# EAGLE design node-v2 (EAGLE 7.2.0)

## Sheet 1 of 2
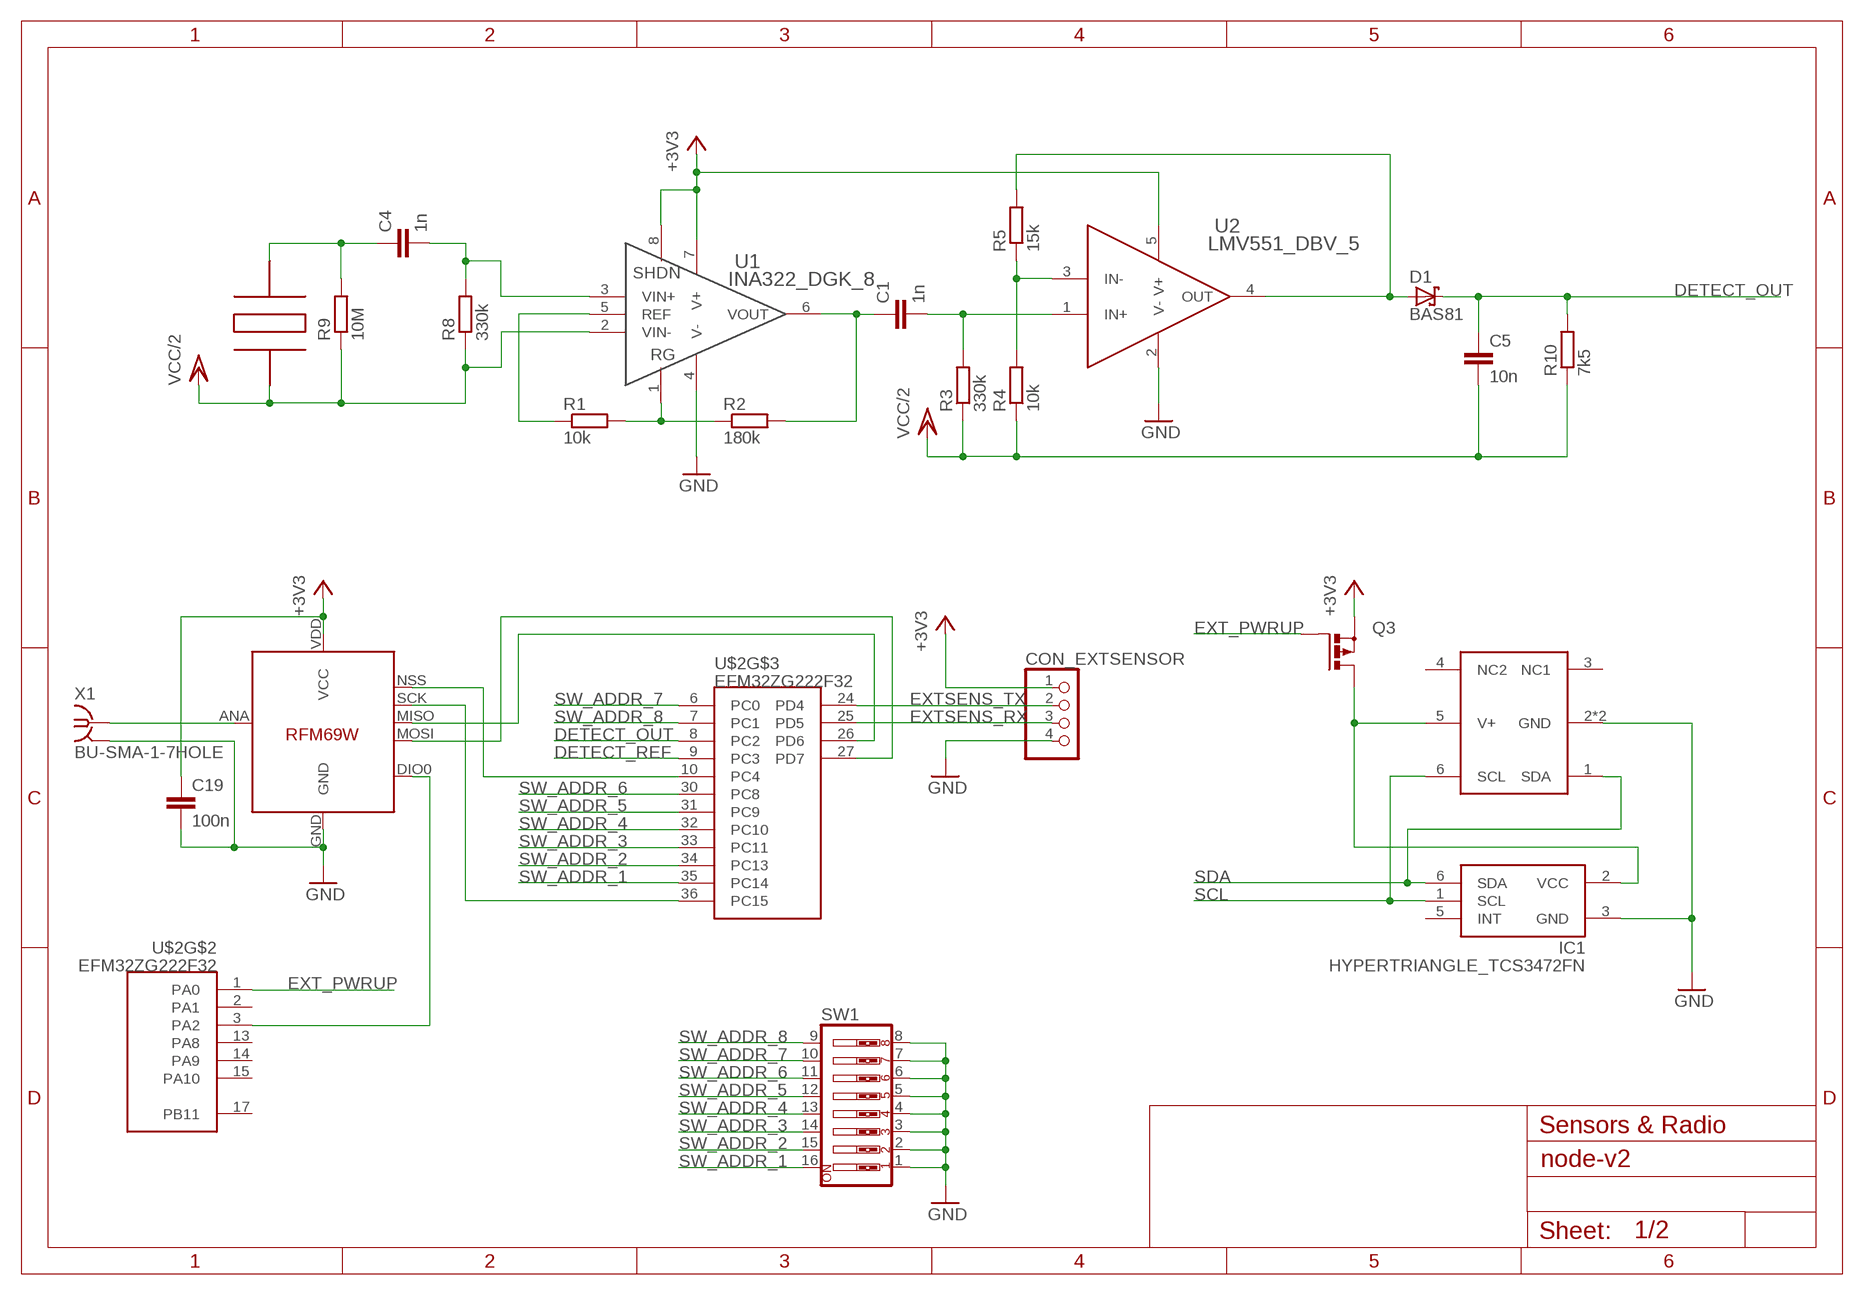
[diagram p0: schematic, sheet 1]

### Parts
C1  1n  CAPPTH  [CAP-PTH-SMALL]
C4  1n  CAPPTH  [CAP-PTH-SMALL]
C5  10n  CAPPTH  [CAP-PTH-SMALL]
C19  100n  CAPPTH  [CAP-PTH-SMALL]
CON_EXTSENSOR  PINHD-1X4  [1X04]
D1  BAS81  SCHOTTKY-DIODEDO35-7  [DO35-7]
IC1  HYPERTRIANGLE_TCS3472FN  [HYPERTRIANGLE_DFN-6]
Q3  PMOSFET_PTO220BH  [TO220BH]
R1  10k  R-EU_0204/7  [0204/7]
R2  180k  R-EU_0204/7  [0204/7]
R3  330k  R-EU_0204/7  [0204/7]
R4  10k  R-EU_0204/7  [0204/7]
R5  15k  R-EU_0204/7  [0204/7]
R8  330k  R-EU_0204/7  [0204/7]
R9  10M  R-EU_0204/7  [0204/7]
R10  7k5  R-EU_0204/7  [0204/7]
RADIO  RFM69  [RFM69W-MINPADS]
SW1  SW_DIP-8  [DIPSWITCH-08]
U1  INA322_DGK_8  [DGK8]
U2  LMV551_DBV_5  [MF05A]
U$1  PIEZOWIREHEADER  [1X02]
U$2  EFM32ZG222F32  [QFP48]
U$3  SHT21  [SHT21]
X1  BU-SMA-1-7HOLE  [SMA_1-7HOLES]

### Nets
+3V3: C19.1 CON_EXTSENSOR.1 Q3.S RADIO.VDD(VCC) U1.7(V+) U1.8(SHDN) U2.5(V+) ; also sheet 2
DETECT_OUT: C5.1 D1.C R10.2 U$2.8(PC2)
DETECT_REF: U$2.9(PC3) ; also sheet 2
EXT_PWRLINE: IC1.2(VCC) Q3.D U$3.5(V+)
EXT_PWRUP: Q3.G U$2.1(PA0)
EXTSENS_RX: CON_EXTSENSOR.3 U$2.25(PD5)
EXTSENS_TX: CON_EXTSENSOR.2 U$2.24(PD4)
GND: C19.2 CON_EXTSENSOR.4 IC1.3(GND) RADIO.GND SW1.1 SW1.2 SW1.3 SW1.4 SW1.5 SW1.6 SW1.7 SW1.8 U1.4(V-) U2.2(V-) U$3.2(GND) U$3.P$1(GND) X1.2 X1.3 X1.4 X1.5 ; also sheet 2
INSTR_FILTERED: C1.2 R3.2 U2.1(IN+)
INSTR_OUT: C1.1 R2.2 U1.6(VOUT)
N$1: RADIO.MISO U$2.26(PD6)
OPAMP_OUT: D1.A R5.2 U2.4(OUT)
OPAMP_VGND: R4.2 R5.1 U2.3(IN-)
PIEZO_FILTERED: C4.2 R8.2 U1.3(VIN+)
PIEZO_OUT: C4.1 R9.2 U$1.1(S+)
RADIO_ANT: RADIO.ANA(ANT) X1.1
RADIO_CS: RADIO.NSS(SEL) U$2.10(PC4)
RADIO_INT: RADIO.DIO0 U$2.3(PA2)
RADIO_MOSI: RADIO.MOSI U$2.27(PD7)
RADIO_SCK: RADIO.SCK U$2.36(PC15)
REFLINE: R1.1 U1.5(REF)
RGLINE: R1.2 R2.1 U1.1(RG)
SCL: IC1.1(SCL) U$3.6(SCL) ; also sheet 2
SDA: IC1.6(SDA) U$3.1(SDA) ; also sheet 2
SW_ADDR_1: SW1.16 U$2.35(PC14)
SW_ADDR_2: SW1.15 U$2.34(PC13)
SW_ADDR_3: SW1.14 U$2.33(PC11)
SW_ADDR_4: SW1.13 U$2.32(PC10)
SW_ADDR_5: SW1.12 U$2.31(PC9)
SW_ADDR_6: SW1.11 U$2.30(PC8)
SW_ADDR_7: SW1.10 U$2.6(PC0)
SW_ADDR_8: SW1.9 U$2.7(PC1)
VCC/2: C5.2 R3.1 R4.1 R8.1 R9.1 R10.1 U1.2(VIN-) U$1.2(S-) ; also sheet 2
Unconnected: IC1.5(INT) U$2.2(PA1) U$2.13(PA8) U$2.14(PA9) U$2.15(PA10) U$2.17(PB11) U$3.3(NC1) U$3.4(NC2)

### Notes on the sheet
- Sensors & Radio

## Sheet 2 of 2
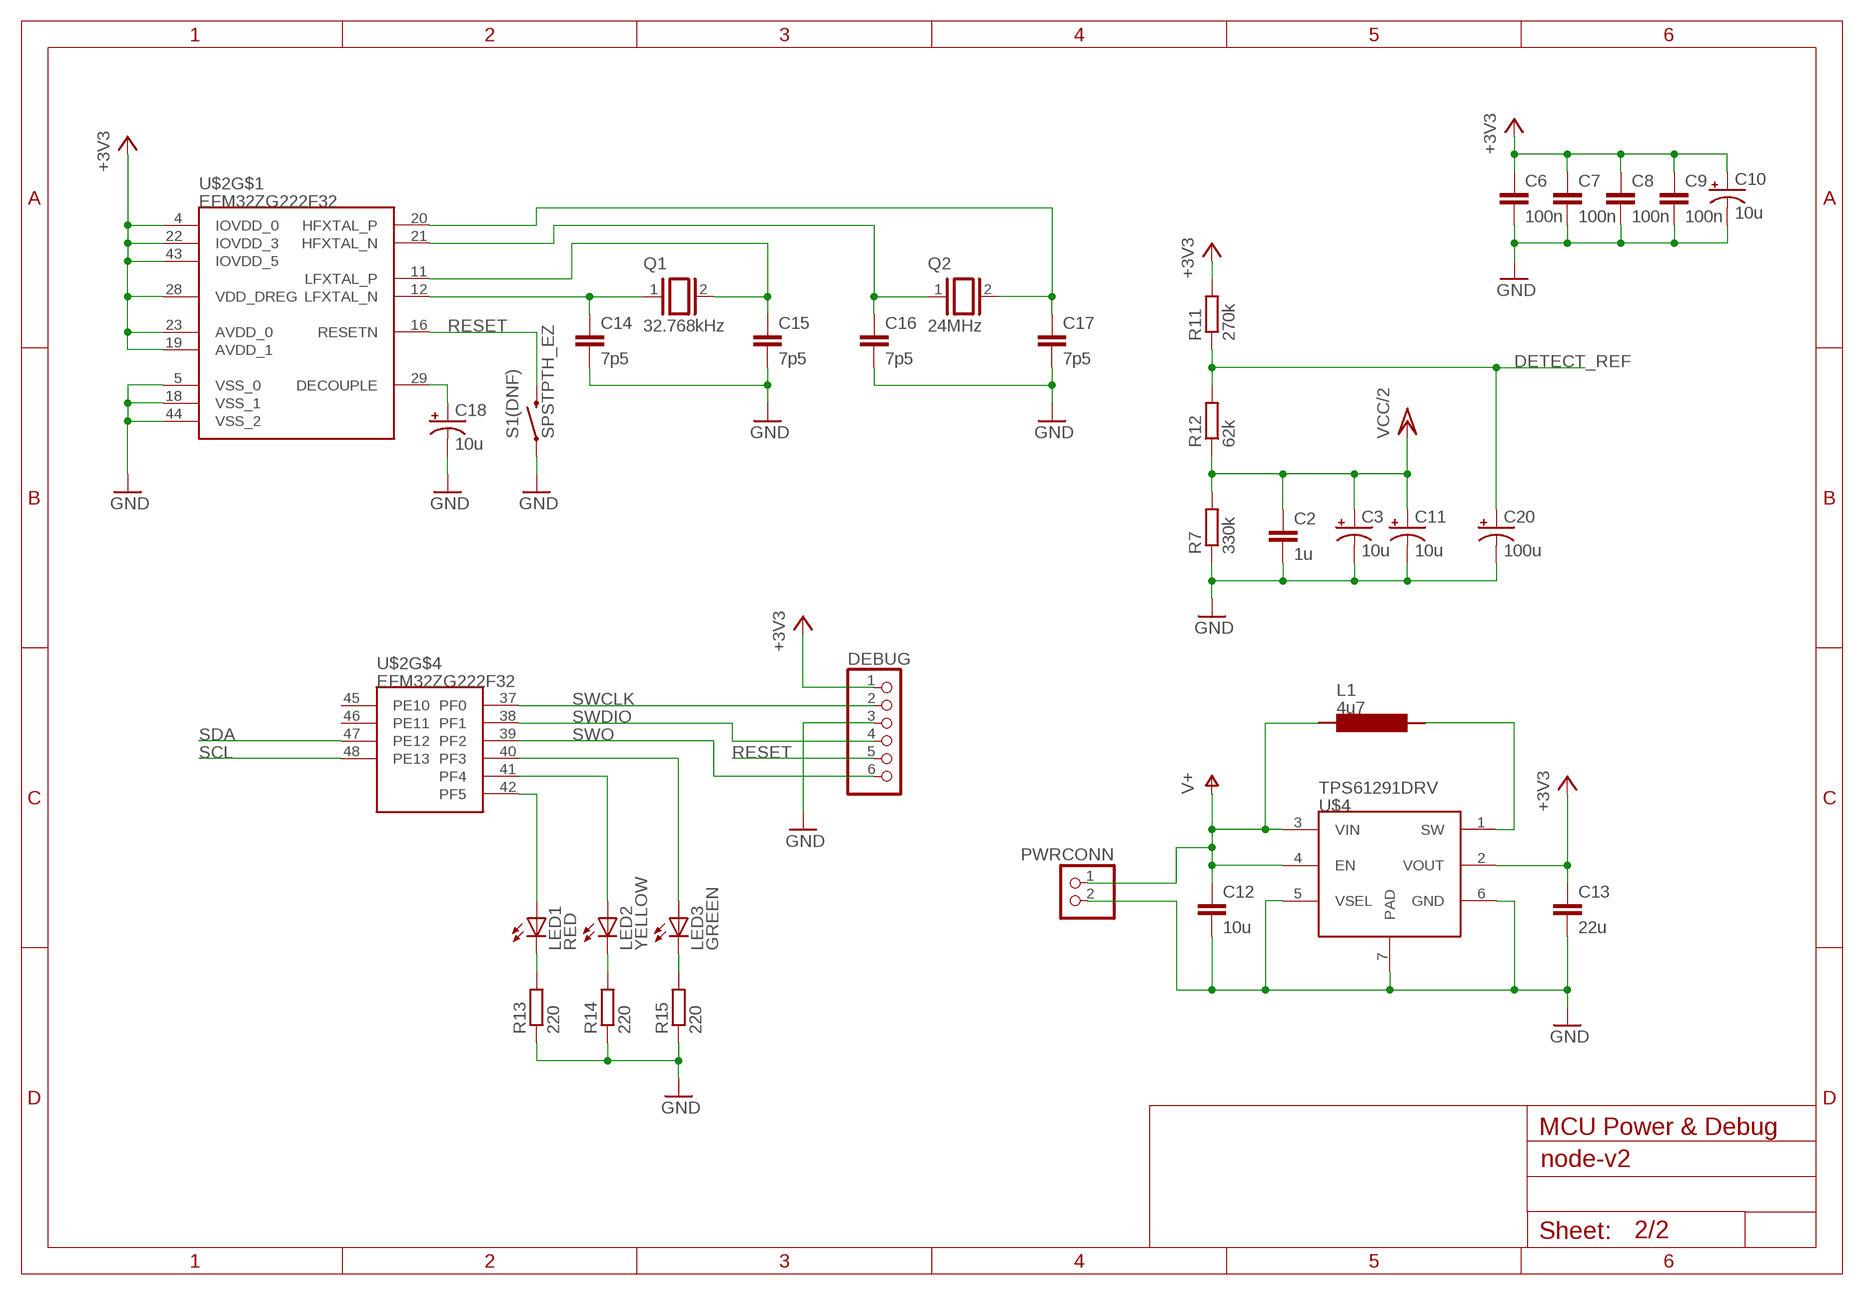
[diagram p1: schematic, sheet 2]

### Parts
C2  1u  CAPPTH  [CAP-PTH-SMALL]
C3  10u  CAP_POLPTH2  [CPOL-RADIAL-10UF-25V]
C6  100n  CAPPTH  [CAP-PTH-SMALL]
C7  100n  CAPPTH1  [CAP-PTH-5MM]
C8  100n  CAPPTH  [CAP-PTH-SMALL]
C9  100n  CAPPTH  [CAP-PTH-SMALL]
C10  10u  CAP_POLPTH2  [CPOL-RADIAL-10UF-25V]
C11  10u  CAP_POLPTH2  [CPOL-RADIAL-10UF-25V]
C12  10u  CAP1206  [1206]
C13  22u  CAP1206  [1206]
C14  7p5  CAPPTH  [CAP-PTH-SMALL]
C15  7p5  CAPPTH  [CAP-PTH-SMALL]
C16  7p5  CAPPTH  [CAP-PTH-SMALL]
C17  7p5  CAPPTH  [CAP-PTH-SMALL]
C18  10u  CAP_POLPTH2  [CPOL-RADIAL-10UF-25V]
C20  100u  CAP_POLPTH2  [CPOL-RADIAL-10UF-25V]
DEBUG  PINHD-1X6  [1X06]
L1  4u7  LTF5022  [LTF5022]
LED1  RED  LED3MM  [LED3MM]
LED2  YELLOW  LED3MM  [LED3MM]
LED3  GREEN  LED3MM  [LED3MM]
PWRCONN  PINHD-1X2  [1X02]
Q1  32.768kHz  XTAL/S  [QS]
Q2  24MHz  XTAL/S  [QS]
R7  330k  R-EU_0204/7  [0204/7]
R11  270k  R-EU_0204/7  [0204/7]
R12  62k  R-EU_0204/7  [0204/7]
R13  220  R-EU_0204/7  [0204/7]
R14  220  R-EU_0204/7  [0204/7]
R15  220  R-EU_0204/7  [0204/7]
S1(DNF)  SPSTPTH_EZ  [TACTILE-PTH-EZ]
U$4  TPS61291DRV  [DRV0006A]

### Nets
+3V3: C6.1 C7.1 C8.1 C9.1 C10.1(+) C13.1 DEBUG.1 R11.2 U$2.4(IOVDD_0) U$2.19(AVDD_1) U$2.22(IOVDD_3) U$2.23(AVDD_0) U$2.28(VDD_DREG) U$2.43(IOVDD_5) U$4.2(VOUT) ; also sheet 1
DECOUPLE: C18.1(+) U$2.29(DECOUPLE)
DETECT_REF: C20.1(+) R11.1 R12.2 ; also sheet 1
GND: C2.2 C3.2(-) C6.2 C7.2 C8.2 C9.2 C10.2(-) C11.2(-) C12.2 C13.2 C14.2 C15.2 C16.2 C17.2 C18.2(-) C20.2(-) DEBUG.3 PWRCONN.2 R7.1 R13.1 R14.1 R15.1 S1(DNF).1 U$2.5(VSS_0) U$2.18(VSS_1) U$2.44(VSS_2) U$4.5(VSEL) U$4.6(GND) U$4.7(PAD) ; also sheet 1
LED_GREEN: LED3.A U$2.40(PF3)
LED_RED: LED1.A U$2.42(PF5)
LED_YELLOW: LED2.A U$2.41(PF4)
LFXTAL_N: C15.1 Q1.2 U$2.11(LFXTAL_P)
LFXTAL_P: C14.1 Q1.1 U$2.12(LFXTAL_N)
N$9: LED1.K(C) R13.2
N$10: LED2.K(C) R14.2
N$11: LED3.K(C) R15.2
RESET: DEBUG.5 S1(DNF).3 U$2.16(RESETN)
SCL: U$2.48(PE13) ; also sheet 1
SDA: U$2.47(PE12) ; also sheet 1
SWCLK: DEBUG.2 U$2.37(PF0)
SWDIO: DEBUG.4 U$2.38(PF1)
SWO: DEBUG.6 U$2.39(PF2)
V+: C12.1 L1.1 PWRCONN.1 U$4.3(VIN) U$4.4(EN)
VCC/2: C2.1 C3.1(+) C11.1(+) R7.2 R12.1 ; also sheet 1
VREG_SW: L1.2 U$4.1(SW)
XTALN: C17.1 Q2.2 U$2.20(HFXTAL_P)
XTALP: C16.1 Q2.1 U$2.21(HFXTAL_N)
Unconnected: U$2.45(PE10) U$2.46(PE11)

### Notes on the sheet
- MCU Power & Debug

## Library data of the parts
C1 C2 C4-C9 C12-C17 C19 = SparkFun-Capacitors:CAP: Capacitor Standard 0603 ceramic capacitor, and 0.1" leaded capacitor.
C3 C10 C11 C18 C20 = SparkFun-Capacitors:CAP_POL: Capacitor Polarized These are standard SMD and PTH capacitors. Normally 10uF, 47uF, and 100uF in electrolytic and tantalum varieties. Always verify the external diameter of the through hole cap, it varies with capacity, voltage, and manufacturer. The EIA devices should be standard.
CON_EXTSENSOR = pinhead:PINHD-1X4: PIN HEADER
D1 = diode:SCHOTTKY-DIODE: Schottky Diode
DEBUG = pinhead:PINHD-1X6: PIN HEADER
IC1 = lightsensor:HYPERTRIANGLE_TCS3472: The TAOS inc. TCS3472 device provides a digital return of red, green, blue (RGB), and clear light sensing values. An IR blocking filter, integrated on-chip and localized to the color sensing photodiodes, minimizes the IR spectral wide component dynamic of the range, incoming and IR light blocking and allows filter make color measurements the TCS3472 an to ideal be made color accurately. sensor solution The high for sensitivity, use under varying lighting conditions and through attenuating materials. The TCS3472 color sensor has a wide range of applications including RGB LED backlight control, solid-state lighting, IR blocking health/fitness filter enables products, the TCS3472 industrial to perform processambient controls light and sensing medical (ALS). diagnostic Ambient equipment. light sensing In addition, is widely the used enable inautomatic display-based display products brightness such for as cell optimal phones, viewing notebooks, and power and savings. TVs to sense The TCS3472, the lighting itself, environment can enter and lower-power wait state between light sensing measurements to further reduce the average power consumption.
L1 = FullyCustom:LTF5022
LED1-LED3 = led:LED: LED OSRAM: - CHIPLED LG R971, LG N971, LY N971, LG Q971, LY Q971, LO R971, LY R971 LH N974, LH R974 LS Q976, LO Q976, LY Q976 LO Q996 - Hyper CHIPLED LW Q18S LB Q993, LB Q99A, LB R99A - SideLED LS A670, LO A670, LY A670, LG A670, LP A670 LB A673, LV A673, LT A673, LW A673 LH A674 LY A675 LS A676, LA A676, LO A676, LY A676, LW A676 LS A679, LY A679, LG A679 - Hyper Micro SIDELED® LS Y876, LA Y876, LO Y876, LY Y876 LT Y87S - SmartLED LW L88C, LW L88S LB L89C, LB L89S, LG L890 LS L89K, LO L89K, LY L89K LS L896, LA L896, LO L896, LY L896 - TOPLED LS T670, LO T670, LY T670, LG T670, LP T670 LSG T670, LSP T670, LSY T670, LOP T670, LYG T670 LG T671, LOG T671, LSG T671 LB T673, LV T673, LT T673, LW T673 LH T674 LS T676, LA T676, LO T676, LY T676, LB T676, LH T676, LSB T676, LW T676 LB T67C, LV T67C, LT T67C, LS T67K, LO T67K, LY T67K, LW E67C LS E67B, LA E67B, LO E67B, LY E67B, LB E67C, LV E67C, LT E67C LW T67C LS T679, LY T679, LG T679 LS T770, LO T770, LY T770, LG T770, LP T770 LB T773, LV T773, LT T773, LW T773 LH T774 LS E675, LA E675, LY E675, LS T675 LS T776, LA T776, LO T776, LY T776, LB T776 LHGB T686 LT T68C, LB T68C - Hyper Mini TOPLED® LB M676 - Mini TOPLED Santana® LG M470 LS M47K, LO M47K, LY M47K Source: http://www.osram.convergy.de LUXEON: - LUMILED® LXK2-PW12-R00, LXK2-PW12-S00, LXK2-PW14-U00, LXK2-PW14-V00 LXK2-PM12-R00, LXK2-PM12-S00, LXK2-PM14-U00 LXK2-PE12-Q00, LXK2-PE12-R00, LXK2-PE12-S00, LXK2-PE14-T00, LXK2-PE14-U00 LXK2-PB12-K00, LXK2-PB12-L00, LXK2-PB12-M00, LXK2-PB14-N00, LXK2-PB14-P00, LXK2-PB14-Q00 LXK2-PR12-L00, LXK2-PR12-M00, LXK2-PR14-Q00, LXK2-PR14-R00 LXK2-PD12-Q00, LXK2-PD12-R00, LXK2-PD12-S00 LXK2-PH12-R00, LXK2-PH12-S00 LXK2-PL12-P00, LXK2-PL12-Q00, LXK2-PL12-R00 Source: www.luxeon.com KINGBRIGHT: KA-3528ASYC Source: www.kingbright.com
PWRCONN = pinhead:PINHD-1X2: PIN HEADER
Q1 Q2 = special:XTAL/S: CRYSTAL
Q3 = transistor-power:PMOSFET_P: Power MOSFET P-Channel
R1-R5 R7-R15 = resistor:R-EU_: RESISTOR, European symbol
RADIO = Moteino:RFM69
S1(DNF) = SparkFun-Electromechanical:SPST: Various NO switches- pushbuttons, reed, etc
SW1 = SparkFun-Electromechanical:SW_DIP-8: DIP Switch 8 Position
U1 = TICustom:INA322_DGK_8; DATASHEETURL: http://www.ti.com/lit/gpn/INA322; DESCRIPTION: Micropower Single-Supply CMOS Instrumentation Amplifier; FAMILY_NAME: SINGLE SUPPLY; GENERIC_PART_NUMBER: INA322; INDUSTRY_STD_PKG_TYPE: MSOP; MANUFACTURER: Texas Instruments; MANUFACTURER_PART_NUMBER: ina322_dgk_8; PACKAGE_DESIGNATOR: DGK; PIN_COUNT: 8; VENDOR: Texas Instruments
U2 = TICustom:LMV551_DBV_5
U$1 = FullyCustom:PIEZO
U$2 = FullyCustom:EFM32ZG222
U$3 = SHT21:SHT21: Tempsensor RS No: 709-8868 MRF No: TMP112AIDRLT
U$4 = FullyCustom:TPS61291
X1 = FullyCustom:BU-SMA-1-7HOLE: FEMALE SMA CONNECTOR Radiall distributor RS 112-3794; OC_FARNELL: unknown; OC_NEWARK: unknown

## Board
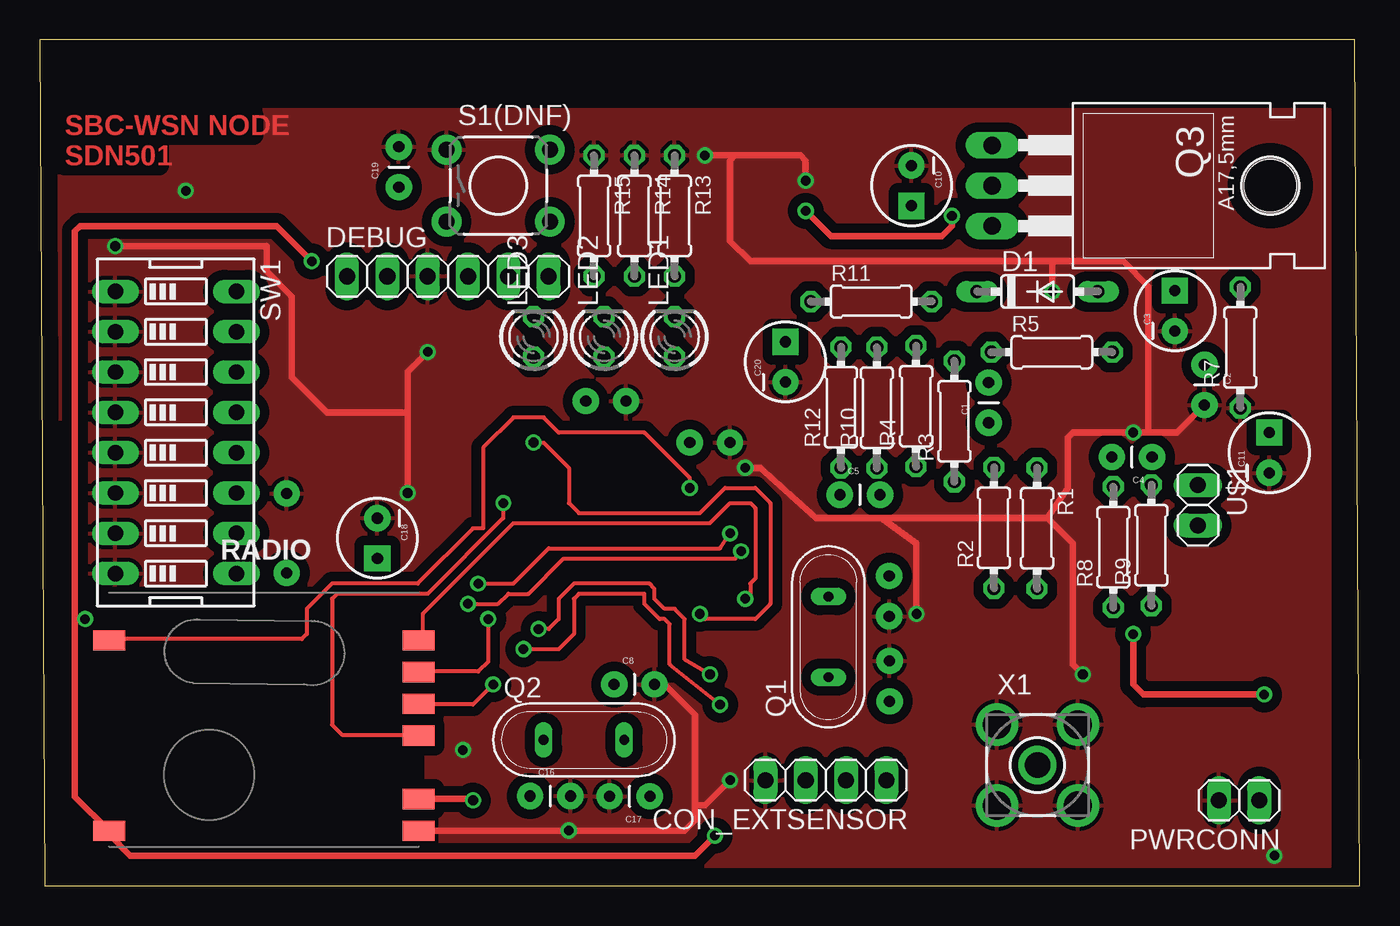
[diagram p2: board, top side]
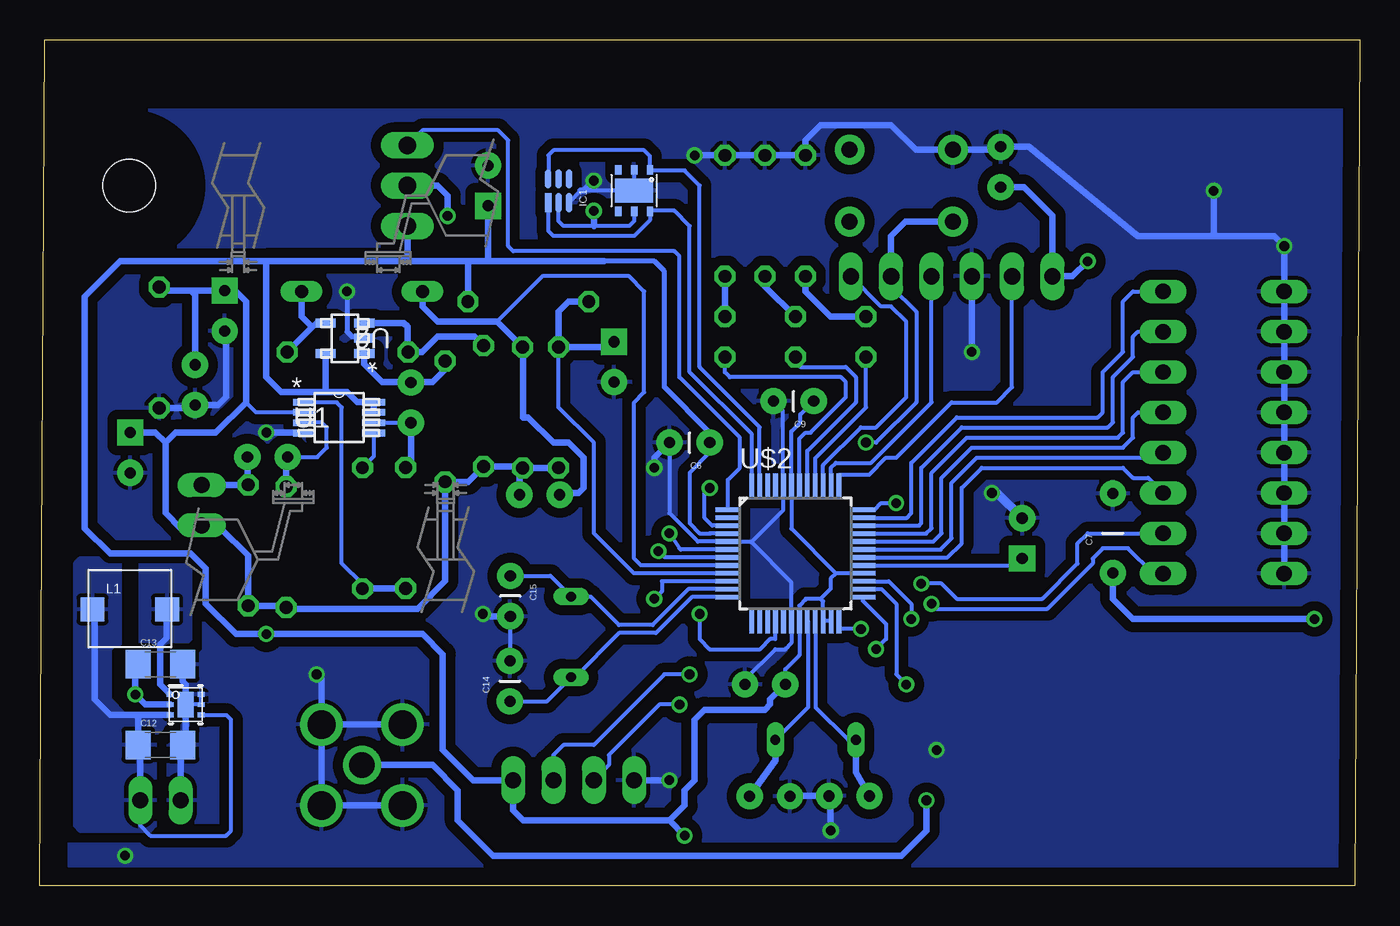
[diagram p3: board, bottom side, seen from below]

Size 83.17 x 53.33 mm. Coordinates in mm from the lower left corner, seen from the top.
Outline: 0.32,0 83.17,0 82.85,53.33 0,53.33 0.32,0
Copper layers (1*16): Top 0.035mm / dielectric 1.5mm / Bottom 0.035mm
Design rules "DepElec *": minimum track width 10mil, minimum drill 23mil, track to track 7mil, track to pad 7mil, pad to pad 7mil, via to via 10mil, smd to smd 7mil, copper to edge 40mil, drill to drill 8mil, minimum pad ring 10mil, minimum via ring 8mil, stop-mask expansion 4mil, vias tented up to drill 0mil, thermal gap 10mil

### Footprints (pad centres in the part's own frame; a part is rotated, then mirrored left to right if it is on the bottom)
CAP-PTH-SMALL = drill 0.7 pad 1.651: 1 0,0; 2 2.54,0
CPOL-RADIAL-10UF-25V = drill 0.7 pad 1.651 square: 1 1.27,0 | drill 0.7 pad 1.651: 2 -1.27,0
CAP-PTH-5MM = drill 0.7 pad 1.651: 1 -2.5,0; 2 2.5,0
1206 = smd 1.6 x 1.8: 1 -1.4,0; 2 1.4,0
1X04 = drill 1.016 long: 1 -3.81,0; 2 -1.27,0; 3 1.27,0; 4 3.81,0
DO35-7 = drill 0.813 long: A 3.81,0; C -3.81,0
1X06 = drill 1.016 long: 1 -6.35,0; 2 -3.81,0; 3 -1.27,0; 4 1.27,0; 5 3.81,0; 6 6.35,0
HYPERTRIANGLE_DFN-6 = smd 1.2 x 0.4: 1 -0.75,0.65; 2 -0.75,0; 3 -0.75,-0.65; 4 0.75,-0.65; 5 0.75,0; 6 0.75,0.65
LTF5022 = smd 1.5 x 1.5: 1 -2.35,0; 2 2.35,0
LED3MM = drill 0.813 octagon: A -1.27,0; K 1.27,0
1X02 = drill 1.016 long: 1 -1.27,0; 2 1.27,0
QS = drill 0.61 long: 1 -2.54,0; 2 2.54,0
TO220BH = drill 1.118 long: D 0,-6.35; G -2.54,-6.35; S 2.54,-6.35 | hole 3.302: 0,11.176
0204/7 = drill 0.813 octagon: 1 -3.81,0; 2 3.81,0
RFM69W-MINPADS = smd 2 x 1.27: ANA 8,-5; DIO0 -11.5,5; GND 8,-7; MISO 8,1; MOSI 8,3; NSS 8,5; SCK 8,-1; VDD -11.5,-7
TACTILE-PTH-EZ = drill 1.016 pad 1.88: 1 -3.251,2.261; 2 3.251,2.261; 3 -3.251,-2.261; 4 3.251,-2.261
DIPSWITCH-08 = drill 0.97 long: 1 -8.89,-3.81; 2 -6.35,-3.81; 3 -3.81,-3.81; 4 -1.27,-3.81; 5 1.27,-3.81; 6 3.81,-3.81; 7 6.35,-3.81; 8 8.89,-3.81; 9 8.89,3.81; 10 6.35,3.81; 11 3.81,3.81; 12 1.27,3.81; 13 -1.27,3.81; 14 -3.81,3.81; 15 -6.35,3.81; 16 -8.89,3.81
DGK8 = smd 1.422 x 0.432: 1 -2.184,0.965; 2 -2.184,0.33; 3 -2.184,-0.33; 4 -2.184,-0.965; 5 2.184,-0.965; 6 2.184,-0.33; 7 2.184,0.33; 8 2.184,0.965
MF05A = smd 1.27 x 0.559: 1 -1.219,0.965; 2 -1.219,0; 3 -1.219,-0.965; 4 1.219,-0.965; 5 1.219,0.965
QFP48 = smd 1.6 x 0.3: 1 -4.25,2.75; 2 -4.25,2.25; 3 -4.25,1.75; 4 -4.25,1.25; 5 -4.25,0.75; 6 -4.25,0.25; 7 -4.25,-0.25; 8 -4.25,-0.75; 9 -4.25,-1.25; 10 -4.25,-1.75; 11 -4.25,-2.25; 12 -4.25,-2.75; 25 4.25,-2.75; 26 4.25,-2.25; 27 4.25,-1.75; 28 4.25,-1.25; 29 4.25,-0.75; 30 4.25,-0.25; 31 4.25,0.25; 32 4.25,0.75; 33 4.25,1.25; 34 4.25,1.75; 35 4.25,2.25; 36 4.25,2.75 | smd 0.3 x 1.6: 13 -2.75,-4.25; 14 -2.25,-4.25; 15 -1.75,-4.25; 16 -1.25,-4.25; 17 -0.75,-4.25; 18 -0.25,-4.25; 19 0.25,-4.25; 20 0.75,-4.25; 21 1.25,-4.25; 22 1.75,-4.25; 23 2.25,-4.25; 24 2.75,-4.25; 37 2.75,4.25; 38 2.25,4.25; 39 1.75,4.25; 40 1.25,4.25; 41 0.75,4.25; 42 0.25,4.25; 43 -0.25,4.25; 44 -0.75,4.25; 45 -1.25,4.25; 46 -1.75,4.25; 47 -2.25,4.25; 48 -2.75,4.25
SHT21 = smd 0.4 x 0.6: 1 -1,-1.3; 2 0,-1.3; 3 1,-1.3; 4 1,1.3; 5 0,1.3; 6 -1,1.3 | smd 2.4 x 1.5: P$1 0,0
DRV0006A = smd 0.45 x 0.3: 1 -0.975,0.65; 2 -0.975,0; 3 -0.975,-0.65; 4 0.975,-0.65; 5 0.975,0; 6 0.975,0.65 | smd 1 x 1.6: 7 0,0
SMA_1-7HOLES = drill 1.6: 1 0,0 | drill 1.778: 2 -2.55,2.55; 3 2.55,2.55; 4 2.55,-2.55; 5 -2.55,-2.55

### Placement (x,y rotation side)
C1  59.79,29.19 90 top
C2  73.39,32.84 270 top
C3  71.53,36.24 90 top
C4  70.08,27.03 180 top
C5  50.41,24.65 0 top
C6  40.96,27.94 180 bottom
C7  15.56,22.23 90 bottom
C8  36.2,12.7 0 top
C9  34.41,30.55 180 bottom
C10  54.93,44.13 270 top
C11  77.47,27.3 90 top
C12  75.56,8.89 0 bottom
C13  75.56,13.97 0 bottom
C14  53.55,11.64 90 bottom
C15  53.52,19.54 270 bottom
C16  30.9,5.67 0 top
C17  38.44,5.66 180 top
C18  21.27,21.91 270 top
C19  22.63,44.04 90 top
C20  46.99,33.02 90 top
CON_EXTSENSOR  49.53,6.67 180 top
D1  62.87,37.47 0 top
DEBUG  25.72,38.42 0 top
IC1  50.48,43.81 90 bottom
L1  77.5,17.43 0 bottom
LED1  40.01,34.61 90 top
LED2  35.56,34.61 90 top
LED3  31.11,34.61 90 top
PWRCONN  75.56,5.4 180 top
Q1  49.69,15.7 90 top
Q2  34.29,9.21 0 top
Q3  66.36,44.13 270 top
R1  62.84,22.55 270 top
R2  60.12,22.57 90 top
R3  57.63,29.28 90 top
R4  55.22,30.23 90 top
R5  63.77,33.63 0 top
R7  75.64,33.94 90 top
R8  67.64,21.35 90 top
R9  70.04,21.47 90 top
R10  52.74,30.14 90 top
R11  52.39,36.83 0 top
R12  50.48,30.16 90 top
R13  40.01,42.23 270 top
R14  37.47,42.23 270 top
R15  34.93,42.23 270 top
RADIO  15.88,10.48 0 top
S1(DNF)  28.89,44.13 0 top
SW1  8.57,28.57 270 top
U1  64.32,29.52 0 bottom
U2  63.94,34.52 180 bottom
U$1  72.97,24 270 top
U$2  35.56,20.95 0 bottom
U$3  45.72,43.81 180 bottom
U$4  73.98,11.43 0 bottom
X1  62.87,7.62 0 top

### Tracks (layer width: path | path; a pad name or v marks a point on that pad's centre or on a via)
+3V3  (via drill 0.6, 0.61)
  Top 0.406: 2.22,16.83 2.22,41.27 2.54,41.59 14.92,41.59 v17.15,39.37 | 2.22,16.83 2.22,5.63 RADIO.VDD 4.38,3.25 5.71,1.91 41.28,1.91 v42.54,3.17 | v2.86,16.83 2.22,16.83 | v68.9,15.88 68.9,12.7 69.53,12.06 v77.15,12.06
  Bottom 0.254: 35.8,25.22 U$2.43 | C8.1 36.19,13.65 35.31,14.54 U$2.19 35.31,17.66 34.93,18.05 34.93,18.1 33.97,18.1 | U$2.4 40.94,22.2 40.96,22.23 41.59,22.23 42.23,22.86 42.23,26.04 40.96,27.3 C6.1 | U$2.23 U$2.22 33.81,17.93 33.97,18.1 | U$2.28 33,19.7 | 33,19.7 33.34,19.37 33.34,18.73 33.97,18.1 | U$2.43 35.81,22.52 33,19.7 | U$2.43 35.81,28.64 35.24,29.21 35.24,29.72 C9.1
  Bottom 0.305: C6.1 40.96,28.57 43.82,31.43 43.82,38.73 44.45,39.37 47.62,39.37
  Bottom 0.406: 56.2,39.37 60.33,39.37 | 60.33,39.37 68.9,39.37 | U1.7 U1.8 63.19,30.48 63.82,31.11 65.09,31.11 | 65.09,31.11 67.94,31.11 68.9,32.07 68.9,39.37 | 47.62,39.37 54.8,39.37 | 54.8,39.37 56.2,39.37 | R11.2 56.2,39.37 | 43.5,4.13 52.71,4.13 53.34,4.76 CON_EXTSENSOR.1 55.88,6.67 57.79,8.57 57.79,14.61 59.05,15.88 v68.9,15.88 70.8,15.88 72.71,17.78 72.71,20 73.66,20.95 78.74,20.95 80.33,22.54 80.33,37.15 78.1,39.37 68.9,39.37 | 43.5,4.13 42.54,5.08 42.54,6.03 41.91,6.67 41.91,10.48 41.28,11.11 37.47,11.11 37.15,11.43 37.15,11.75 C8.1 | C19.1 21.18,44.03 19.37,42.23 DEBUG.1 18.1,38.42 v17.15,39.37 | v42.54,3.17 43.5,4.13 | C7.1 15.56,18.1 14.29,16.83 v2.86,16.83 | C10.1 54.93,39.5 54.8,39.37 | U$4.2 76.52,11.43 v77.15,12.06 77.15,13.78 C13.1 | U2.5 65.16,31.19 65.09,31.11 | Q3.S 60.01,39.69 60.33,39.37
DECOUPLE
  Bottom 0.254: U$2.29 21.7,20.2 C18.1
DETECT_OUT
  Bottom 0.254: U$2.8 45.29,20.2 45.72,20.64 45.72,30.48 45.08,31.11 45.08,37.47 46.04,38.42 51.5,38.42 54.35,35.56
  Bottom 0.406: 52.52,33.73 R10.2 | R10.2 52.71,33.91 52.71,29.53 52.39,29.53 50.8,27.94 49.85,27.94 48.9,26.99 48.9,25.08 49.21,24.77 50.3,24.77 C5.1 | D1.C 59.05,36.51 58.1,35.56 54.35,35.56 R10.2
DETECT_REF
  Bottom 0.254: U$2.9 45.74,19.7 48.26,22.23 48.26,27.94 50.48,30.16 R12.2
  Bottom 0.406: R11.1 49.85,36.83 50.48,36.2 R12.2 47.31,33.97 C20.1
EXT_PWRLINE  (via drill 0.61)
  Top 0.406: v48.26,42.55 49.85,40.96 56.83,40.96 57.47,41.59 v57.47,42.23
  Bottom 0.254: U$3.5 45.72,41.91 46.04,41.59 48.26,41.59 50.16,41.59 50.48,41.91 IC1.2
  Bottom 0.406: v48.26,42.55 48.26,41.59 | Q3.D 58.1,44.13 57.47,43.5 v57.47,42.23
EXT_PWRUP
  Bottom 0.254: U$2.1 39.81,25.59 39.05,26.35 39.05,28.26 42.86,32.07 42.86,39.69 43.18,40.01 53.34,40.01 53.66,40.32 53.66,46.99 54.29,47.62 59.05,47.62 Q3.G
EXTSENS_RX  (via drill 0.61)
  Top 0.254: v42.86,11.43 39.69,13.97 39.69,16.51 39.37,16.83 39.05,16.83 38.1,17.78 38.1,18.41 33.97,18.41 33.65,18.1 33.65,15.88 32.7,14.92 v30.48,14.92
  Bottom 0.254: U$2.25 31.31,17.98 29.84,16.51 29.84,15.56 v30.48,14.92 | v42.86,11.43 44.13,11.43 47.31,8.26 47.31,7.62 CON_EXTSENSOR.3
EXTSENS_TX  (via drill 0.61)
  Top 0.254: v42.23,13.34 40.64,14.29 40.64,16.83 40.01,17.46 39.37,17.46 38.73,18.1 38.73,18.73 38.42,19.05 33.65,19.05 32.7,18.1 32.7,16.83 32.07,16.19 v31.43,16.19
  Bottom 0.254: U$2.24 32.81,16.19 v31.43,16.19 | v42.23,13.34 43.82,13.34 48.26,8.89 50.16,8.89 50.8,8.26 CON_EXTSENSOR.2
GND  (via drill 0.6, 0.61)
  Top 0.406: 23.18,29.84 v23.18,24.77 23.18,25.72 | 23.18,29.84 23.18,32.38 v24.45,33.66 | v55.25,17.14 55.25,21.59 53.02,23.18 | 53.02,23.18 48.9,23.18 45.4,26.35 v44.45,26.35 | 53.02,23.18 63.5,23.18 | 63.5,23.18 64.77,25.08 64.77,28.26 65.09,28.57 v68.9,28.57 69.85,28.57 | 63.5,23.18 65.09,21.59 65.09,13.97 v65.72,13.34 | v4.76,40.32 14.29,40.32 14.29,38.73 15.87,37.15 15.87,32.07 18.1,29.84 23.18,29.84 | 23.57,3.17 RADIO.GND 28.88,3.48 v33.34,3.49 40.64,3.49 41.28,4.13 41.28,5.08 | C8.2 39.37,12.7 41.28,10.79 41.28,5.08 | v48.26,44.45 48.26,45.72 47.94,46.04 43.82,46.04 | 43.82,46.04 v41.91,46.04 | 41.28,5.08 41.91,5.08 v43.5,6.67 | 69.85,28.57 71.66,28.57 C2.2 | 69.85,28.57 69.85,37.78 68.26,39.37 63.82,39.37 | 63.82,39.37 44.77,39.37 43.5,40.64 43.5,45.72 43.82,46.04 | v63.82,37.47 63.82,39.37
  Bottom 0.254: U$4.6 U$4.5 U$4.7 | C15.2 53.52,14.2 C14.2 | 36.35,25.25 U$2.44 | 39.85,21.67 U$2.5 | C8.2 38.73,13.02 36.83,14.92 36.19,14.92 35.81,15.31 U$2.18 35.81,19.14 38.34,21.67 | U$2.5 41.71,21.7 43.5,23.5 C6.2 | 36.35,25.25 36.35,23.65 38.34,21.67 | 38.34,21.67 39.77,21.67 U$2.5 | U$3.2 U$3.P$1 49.08,43.81 IC1.3 | 36.35,25.25 36.35,29.96 C9.2
  Bottom 0.305: v63.82,37.47 63.82,34.92 63.5,34.61 62.81,34.61 U2.2
  Bottom 0.406: R7.1 73.56,30.13 C2.2 71.93,30.3 71.44,30.8 71.44,34.89 | C17.2 35.89,5.67 C16.2 33.34,5.57 v33.34,3.49 | SW1.8 SW1.7 SW1.6 SW1.5 SW1.4 SW1.3 SW1.2 SW1.1 v4.76,40.32 5.4,40.96 9.21,40.96 | v24.45,33.66 DEBUG.3 | C15.2 55.1,17 v55.25,17.14 | v44.45,26.35 44.45,26.99 C6.2 | 49.08,43.81 48.9,43.81 v48.26,44.45 | v41.91,46.04 R13.1 R14.1 R15.1 34.93,46.99 33.97,47.94 29.53,47.94 27.98,46.39 S1(DNF).1 22.81,46.39 C19.2 20.86,46.58 13.97,40.96 9.21,40.96 | v43.5,6.67 CON_EXTSENSOR.4 | X1.5 X1.4 X1.3 | X1.3 X1.2 | X1.3 65.41,13.03 v65.72,13.34 | v68.9,28.57 66.52,28.57 U1.4 | C13.2 74.16,12.89 73.98,12.7 U$4.7 73.98,9.08 C12.2 74.3,8.76 PWRCONN.2 | v9.21,43.81 9.21,40.96
  Bottom 0.61: v23.18,24.77 22.86,24.77 C18.2
  other vias: 77.79,1.91 26.67,8.57
  pour Bottom (isolate 0.61, rank 3): 0.95,1.27 81.28,1.27 81.28,48.9 0.64,48.9
  pour Top (isolate 0.61, rank 3): 0.95,48.9 0.95,1.27 81.28,1.27 81.28,48.9
INSTR_FILTERED
  Bottom 0.406: R3.2 57.63,32.54 58.42,31.75 59.76,31.75 C1.2 59.81,31.75 61.6,31.75 62.72,32.88 U2.1
INSTR_OUT
  Bottom 0.254: C1.1 U1.6
  Bottom 0.406: C1.1 59.79,26.71 R2.2
LED_GREEN
  Bottom 0.254: U$2.40 34.31,26.97 31.11,30.16 LED3.A
LED_RED
  Bottom 0.254: U$2.42 35.31,28.19 34.93,28.57 34.61,28.57 32.39,30.8 32.39,31.75 32.7,32.07 39.69,32.07 40.01,32.38 LED1.A
LED_YELLOW
  Bottom 0.254: LED2.A 35.56,33.02 35.24,32.7 32.39,32.7 31.75,32.07 31.75,30.48 34.81,27.42 U$2.41
LFXTAL_N
  Bottom 0.254: C15.1 50.99,19.54 Q1.2 48.47,18.24 46.67,16.45 44.56,16.45 42.3,18.7 U$2.11
LFXTAL_P
  Bottom 0.254: C14.1 51.21,11.64 Q1.1 49.45,13.16 46.67,15.94 44.34,15.94 42.08,18.2 U$2.12
N$1  (via drill 0.6)
  Top 0.254: v28.58,12.7 27.31,11.43 23.92,11.43 RADIO.MISO
  Bottom 0.254: U$2.26 30.13,18.7 29.21,17.78 29.21,13.34 v28.58,12.7
N$2
  cutout Top: 3.81,18.73 3.81,2.54 24.13,2.54 24.13,18.73
N$9
  Bottom 0.406: R13.2 LED1.K
N$10
  Bottom 0.406: R14.2 37.47,37.78 LED2.K
N$11
  Bottom 0.406: R15.2 34.93,37.47 33.34,35.88 LED3.K
OPAMP_OUT
  Bottom 0.406: U2.4 65.73,35.48 66,35.21 | 66,35.21 R5.2 | D1.A 66.68,35.88 66,35.21
OPAMP_VGND
  Bottom 0.406: R4.2 55.78,34.61 58.1,34.61 59.08,33.63 R5.1 60.01,33.69 60.01,35.24 60.25,35.48 U2.3
PIEZO_FILTERED
  Bottom 0.254: C4.2 65.68,27.03 65.09,27.62 65.09,28.89 65.41,29.21 66.48,29.21 U1.3
  Bottom 0.406: R8.2 67.64,26.93 C4.2
PIEZO_OUT
  Bottom 0.406: C4.1 70.08,25.32 R9.2 72.96,25.28 U$1.1
RADIO_ANT  (via drill 0.61)
  Top 0.406: RADIO.ANA 27.22,5.48 v27.31,5.4
  Bottom 0.406: X1.1 58.42,7.62 56.83,6.03 56.83,4.13 54.61,1.91 28.89,1.91 27.31,3.49 v27.31,5.4
RADIO_CS  (via drill 0.61)
  Top 0.254: 24.37,15.48 RADIO.NSS 24.13,15.73 24.13,17.14 29.84,22.86 42.23,22.86 43.5,24.13 44.77,24.13 45.08,23.81 45.08,19.37 44.77,19.05 44.77,18.41 v44.45,18.1
  Bottom 0.254: U$2.10 43.98,19.2 43.98,18.57 v44.45,18.1
RADIO_INT  (via drill 0.61)
  Top 0.254: v40.96,25.08 40.96,25.72 38.1,28.57 32.7,28.57 31.75,29.53 29.84,29.53 27.94,27.62 27.94,22.54 27.31,22.54 23.81,19.05 18.42,19.05 16.83,17.46 16.83,15.88 16.51,15.56 4.46,15.56 RADIO.DIO0
  Bottom 0.254: U$2.3 40.8,22.7 41.28,23.18 41.28,24.77 v40.96,25.08
RADIO_MOSI  (via drill 0.6)
  Top 0.254: v28.26,16.83 28.26,14.13 27.63,13.51 23.91,13.51 RADIO.MOSI
  Bottom 0.254: U$2.27 29.68,19.2 28.26,17.78 v28.26,16.83
RADIO_SCK  (via drill 0.6)
  Top 0.254: v29.21,24.13 29.21,23.18 24.45,18.41 18.73,18.41 18.42,18.1 18.42,10.16 19.05,9.53 23.83,9.53 RADIO.SCK
  Bottom 0.254: U$2.36 30.59,23.7 30.16,24.13 v29.21,24.13
REFLINE
  Bottom 0.254: U1.5 62.13,27.07 R1.1
RESET  (via drill 0.61)
  Top 0.254: v41.59,17.14 41.91,16.83 45.08,16.83 46.04,17.78 46.04,24.13 45.08,25.08 43.18,25.08 41.59,23.5 33.97,23.5 33.34,24.13 33.34,26.35 31.75,27.94 v31.11,27.94
  Bottom 0.254: v41.59,17.14 41.59,15.56 40.96,14.92 37.78,14.92 37.15,15.56 36.83,15.56 36.83,16.68 U$2.16 | DEBUG.5 29.53,37.78 27.94,36.2 27.94,30.48 30.48,27.94 v31.11,27.94
  Bottom 0.406: S1(DNF).3 28.61,41.87 29.53,40.96 DEBUG.5
RGLINE
  Bottom 0.254: U1.1 64.45,30.48 64.14,30.16 64.14,20.32 62.84,19.03 R1.2
  Bottom 0.406: R1.2 60.12,18.73 R2.1
SCL
  Bottom 0.254: IC1.1 51.12,41.27 50.8,40.96 45.72,40.96 44.72,41.96 U$3.6 44.69,42.55 43.18,42.55 42.23,41.59 42.23,32.38 38.31,28.47 U$2.48
SDA
  Bottom 0.254: IC1.6 51.12,44.58 51.12,46.04 50.8,46.35 45.08,46.35 44.72,45.99 U$3.1 44.69,45.09 42.54,45.09 41.59,44.13 41.59,32.7 37.81,28.92 U$2.47
SW_ADDR_1
  Bottom 0.254: U$2.35 28.55,23.2 28.26,23.5 28.26,26.67 25.4,29.53 16.51,29.53 16.19,29.84 16.19,32.38 14.92,33.66 14.92,36.83 14.29,37.47 SW1.16
SW_ADDR_2
  Bottom 0.254: U$2.34 27.78,22.7 27.62,22.86 27.62,26.35 25.08,28.89 15.87,28.89 15.56,29.21 15.56,32.07 14.29,33.34 14.29,34.61 13.97,34.92 SW1.15
SW_ADDR_3
  Bottom 0.254: U$2.33 27.33,22.2 26.99,22.54 26.99,26.04 24.77,28.26 15.24,28.26 14.92,28.57 14.92,31.75 14.29,32.38 SW1.14
SW_ADDR_4
  Bottom 0.254: U$2.32 26.87,21.7 26.35,22.23 26.35,25.72 24.45,27.62 14.92,27.62 14.29,28.26 14.29,29.53 13.97,29.84 SW1.13
SW_ADDR_5
  Bottom 0.254: U$2.31 26.42,21.2 25.72,21.91 25.72,25.4 24.13,26.99 12.7,26.99 SW1.12
SW_ADDR_6
  Bottom 0.254: U$2.30 25.97,20.7 25.08,21.59 25.08,25.08 23.81,26.35 14.92,26.35 14.29,25.72 13.34,25.72 SW1.11
SW_ADDR_7  (via drill 0.6)
  Top 0.254: v43.5,22.23 42.86,21.27 32.07,21.27 29.84,19.05 v27.62,19.05
  Bottom 0.254: SW1.10 17.15,22.23 17.78,21.59 17.78,20.32 20,18.1 25.4,18.1 26.35,19.05 v27.62,19.05 | v43.5,22.23 42.86,21.27 42.79,21.2 U$2.6
SW_ADDR_8  (via drill 0.6)
  Top 0.254: v26.99,17.78 28.89,17.78 29.53,18.41 30.8,18.41 33.02,20.64 43.82,20.64 v44.2,21.1
  Bottom 0.254: SW1.9 13.02,19.68 14.6,21.27 16.19,21.27 16.83,20.64 16.83,20.32 19.68,17.46 26.67,17.46 v26.99,17.78 | U$2.7 43.81,20.7 v44.2,21.1
SWCLK
  Bottom 0.254: U$2.37 32.81,25.93 30.9,25.93 29.84,26.99 29.21,26.99 25.72,30.48 22.86,30.48 21.91,31.43 DEBUG.2
SWDIO
  Bottom 0.254: U$2.38 33.31,26.38 33.02,26.67 30.8,26.67 26.99,30.48 DEBUG.4
SWO
  Bottom 0.254: U$2.39 33.81,26.52 31.43,28.89 30.48,28.89 28.58,30.8 28.58,35.56 29.53,36.51 30.16,36.51 DEBUG.6
V+
  Bottom 0.254: U$4.4 71.42,10.78 71.12,10.48 71.12,3.49 71.44,3.17 76.2,3.17 76.83,3.81 PWRCONN.1
  Bottom 0.406: 77.15,10.78 U$4.3 76.5,10.78 76.52,10.79 | 77.15,10.78 78.72,10.78 79.69,11.75 79.69,17.28 L1.1 | 77.15,10.78 76.96,10.59 C12.1 76.83,8.76 PWRCONN.1
  pour Bottom (isolate 0.406): 75.88,3.81 75.88,9.53 75.25,10.16 75.25,10.48 75.56,10.79 77.79,10.79 78.74,11.75 78.74,14.92 78.42,15.24 78.1,15.24 78.1,20.64 80.64,20.64 80.96,20.32 80.96,3.81 80.64,3.49 76.2,3.49
VCC/2
  Bottom 0.254: 70.16,30.48 70.17,30.48 69.54,29.85 U1.2
  Bottom 0.406: R10.1 52.84,26.42 R4.1 56.17,25.47 R3.1 57.63,19.21 59.37,17.46 67.56,17.46 R8.1 67.76,17.66 R9.1 70.04,20.83 71.76,22.54 72.79,22.54 | 72.79,22.54 U$1.2 | 72.79,22.54 74.3,22.54 75.25,23.5 75.25,27.94 | 75.25,27.94 74.61,28.57 72.07,28.57 70.17,30.48 70.17,36.83 70.85,37.51 C3.1 73.66,37.51 | 73.66,37.51 75.41,37.51 R7.2 | C2.1 73.39,37.24 73.66,37.51 | C5.2 52.95,26.12 R10.1 | R10.1 50.51,26.33 R12.1 | C11.1 75.88,28.57 75.25,27.94
VREG_SW
  Bottom 0.406: 75.25,17.33 L1.2 75.16,15.65 75.57,15.24 75.57,12.7 U$4.1
  pour Bottom (isolate 0.406): 76.83,15.24 73.98,15.24 73.66,15.56 73.66,20.32 73.98,20.64 76.83,20.64
XTALN
  Bottom 0.254: U$2.20 34.77,16.66 34.77,11.27 Q2.2
  Bottom 0.406: Q2.2 36.83,7.9 C17.1
XTALP
  Bottom 0.254: U$2.21 34.29,16.68 34.29,11.27 32.23,9.21 Q2.1
  Bottom 0.406: Q2.1 31.75,7.16 C16.1

### Text on the board
Top: SBC-WSN NODE | SDN501